# EAGLE design caretaker-easyvr (EAGLE 6.5.0)
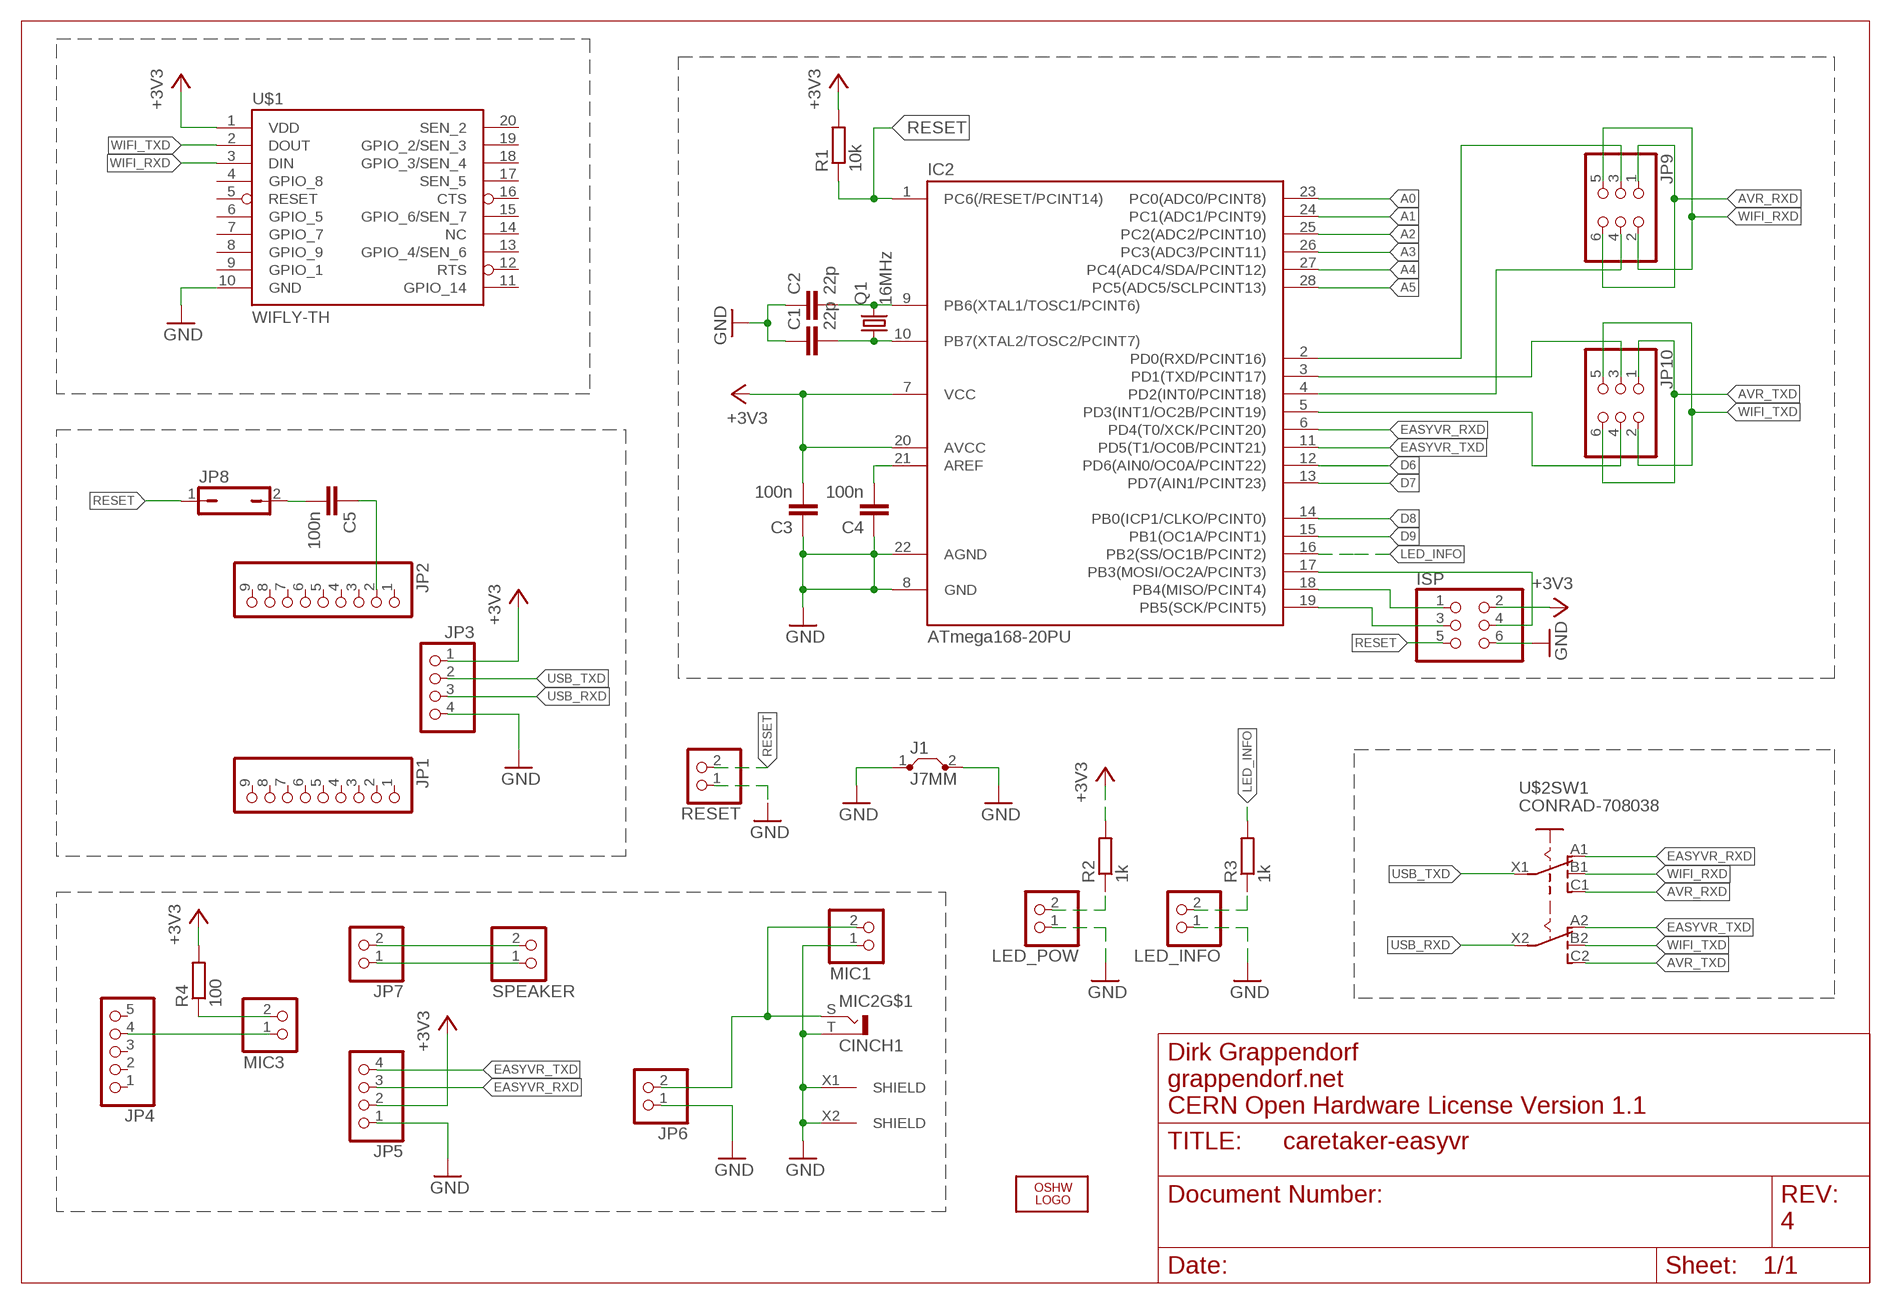
[diagram p0: schematic, sheet 1]

## Parts
C1  22p  C-EU025-025X050  [C025-025X050]
C2  22p  C-EU025-025X050  [C025-025X050]
C3  100n  C-EU025-024X044  [C025-024X044]
C4  100n  C-EU025-024X044  [C025-024X044]
C5  100n  C-EU025-024X044  [C025-024X044]
IC2  ATmega168-20PU  ATMEGA48/88/168-PU  [DIL28-3]
ISP  PINHD-2X3  [2X03]
J1  J7MM  [07]
JP1  PINHD-1X9  [1X09]
JP2  PINHD-1X9  [1X09]
JP3  PINHD-1X4  [1X04]
JP4  PINHD-1X5_2.00  [1X05M]
JP5  PINHD-1X4_2.00  [1X04M]
JP6  PINHD-1X2_2.00  [1X02M]
JP7  PINHD-1X2_2.00  [1X02M]
JP8  JP1Q  [JP1]
JP9  PINHD-2X3_2.54  [2X03]
JP10  PINHD-2X3_2.54  [2X03]
LED_INFO  PINHD-1X2_2.54  [1X02]
LED_POW  PINHD-1X2_2.54  [1X02]
LOGO2  OSHW_LOGO_10MILX0350-NT-BOTTOM  [OSHW_10X350_NOTEXT_BOTTOM]
MIC1  PINHD-1X2_2.54  [1X02]
MIC2  CINCH1  [CINCH1]
MIC3  PINHD-1X2_2.54  [1X02]
Q1  16MHz  CRYSTALHC49U-V  [HC49U-V]
R1  10k  R-EU_0204/7  [0204/7]
R2  1k  R-EU_0204/7  [0204/7]
R3  1k  R-EU_0204/7  [0204/7]
R4  100  R-EU_0204/7  [0204/7]
RESET  PINHD-1X2_2.54  [1X02]
SPEAKER  PINHD-1X2_2.54  [1X02]
U$1  WIFLY-TH  [WIFLY-TH]
U$2  CONRAD-708038  [CONRAD-708038]

## Nets
+3V3: C3.2 IC2.7(VCC) IC2.20(AVCC) ISP.2 JP3.1 JP5.2 R1.2 R2.2 R4.2 U$1.1(VDD)
A0: IC2.23(PC0(ADC0/PCINT8))
A1: IC2.24(PC1(ADC1/PCINT9))
A2: IC2.25(PC2(ADC2/PCINT10))
A3: IC2.26(PC3(ADC3/PCINT11))
A4: IC2.27(PC4(ADC4/SDA/PCINT12))
A5: IC2.28(PC5(ADC5/SCLPCINT13))
AVR_RXD: JP9.1 JP9.6 U$2.C1(SW1:C1)
AVR_TXD: JP10.1 JP10.6 U$2.C2(SW1:C2)
D6: IC2.12(PD6(AIN0/OC0A/PCINT22))
D7: IC2.13(PD7(AIN1/PCINT23))
D8: IC2.14(PB0(ICP1/CLKO/PCINT0))
D9: IC2.15(PB1(OC1A/PCINT1))
EASYVR_RXD: IC2.6(PD4(T0/XCK/PCINT20)) JP5.3 U$2.A1(SW1:A1)
EASYVR_TXD: IC2.11(PD5(T1/OC0B/PCINT21)) JP5.4 U$2.A2(SW1:A2)
GND: C1.1 C2.1 C3.1 C4.1 IC2.8(GND) IC2.22(AGND) ISP.6 J1.1 J1.2 JP3.4 JP5.1 JP6.1 LED_INFO.1 LED_POW.1 MIC1.1 MIC2.T MIC2.X1(SHIELD) MIC2.X2(SHIELD) RESET.1 U$1.10(GND)
LED_INFO: IC2.16(PB2(SS/OC1B/PCINT2)) R3.2
MIC: JP6.2 MIC1.2 MIC2.S
N$5: C2.2 IC2.9(PB6(XTAL1/TOSC1/PCINT6)) Q1.2
N$6: C1.2 IC2.10(PB7(XTAL2/TOSC2/PCINT7)) Q1.1
N$7: C4.2 IC2.21(AREF)
N$8: IC2.18(PB4(MISO/PCINT4)) ISP.1
N$9: IC2.19(PB5(SCK/PCINT5)) ISP.3
N$10: C5.2 JP8.2
N$11: C5.1 JP2.2
N$12: LED_POW.2 R2.1
N$13: LED_INFO.2 R3.1
N$14: JP7.2 SPEAKER.2
N$15: JP7.1 SPEAKER.1
N$16: JP4.4 MIC3.1
N$17: MIC3.2 R4.1
N$18: IC2.2(PD0(RXD/PCINT16)) JP9.3
N$19: IC2.4(PD2(INT0/PCINT18)) JP9.4
N$20: IC2.3(PD1(TXD/PCINT17)) JP10.3
N$21: IC2.5(PD3(INT1/OC2B/PCINT19)) JP10.4
N$22: IC2.17(PB3(MOSI/OC2A/PCINT3)) ISP.4
RESET: IC2.1(PC6(/RESET/PCINT14)) ISP.5 JP8.1 R1.1 RESET.2
USB_RXD: JP3.3 U$2.X2(SW1:X2)
USB_TXD: JP3.2 U$2.X1(SW1:X1)
WIFI_RXD: JP9.2 JP9.5 U$1.3(DIN) U$2.B1(SW1:B1)
WIFI_TXD: JP10.2 JP10.5 U$1.2(DOUT) U$2.B2(SW1:B2)
Unconnected: JP1.1 JP1.2 JP1.3 JP1.4 JP1.5 JP1.6 JP1.7 JP1.8 JP1.9 JP2.1 JP2.3 JP2.4 JP2.5 JP2.6 JP2.7 JP2.8 JP2.9 JP4.1 JP4.2 JP4.3 JP4.5 U$1.4(GPIO_8) U$1.5(RESET) U$1.6(GPIO_5) U$1.7(GPIO_7) U$1.8(GPIO_9) U$1.9(GPIO_1) U$1.11(GPIO_14) U$1.12(RTS) U$1.13(GPIO_4/SEN_6) U$1.14(NC) U$1.15(GPIO_6/SEN_7) U$1.16(CTS) U$1.17(SEN_5) U$1.18(GPIO_3/SEN_4) U$1.19(GPIO_2/SEN_3) U$1.20(SEN_2) U$2.SHIELD1(SHIELD1:SHIELD) U$2.SHIELD2(SHIELD2:SHIELD)

## Notes on the sheet
- Dirk Grappendorf
- grappendorf.net
- CERN Open Hardware License Version 1.1
- 4

## Library data of the parts
C1-C5 = rcl:C-EU: CAPACITOR, European symbol
IC2 = atmega8:ATMEGA48/88/168-PU
ISP = pinhead:PINHD-2X3: PIN HEADER
J1 = jumper:J: Bridge
JP1 JP2 = pinhead:PINHD-1X9: PIN HEADER
JP3 = pinhead:PINHD-1X4: PIN HEADER
JP4 = pinhead-1:PINHD-1X5: PIN HEADER
JP5 = pinhead-1:PINHD-1X4: PIN HEADER
JP6 JP7 LED_INFO LED_POW MIC1 MIC3 RESET SPEAKER = pinhead-1:PINHD-1X2: PIN HEADER
JP8 = jumper:JP1Q: JUMPER
JP9 JP10 = pinhead-1:PINHD-2X3: PIN HEADER
LOGO2 = OSHW:OSHW_LOGO_10MIL
MIC2 = grapelabs-connectors:CINCH1: RCA connectors according to JEITA RC-5231 Cinch RCA-Einbaukupplung nach JEITA RC-5231, abgewinkelte Ausführung Source: http://www.lumberg.de/Produkte/PDFs/WBTOR1.pdf
Q1 = crystal:CRYSTAL: CRYSTAL
R1-R4 = rcl:R-EU_: RESISTOR, European symbol
U$1 = grapelabs:WIFLY
U$2 = grapelabs-switches:CONRAD-708038

## Board
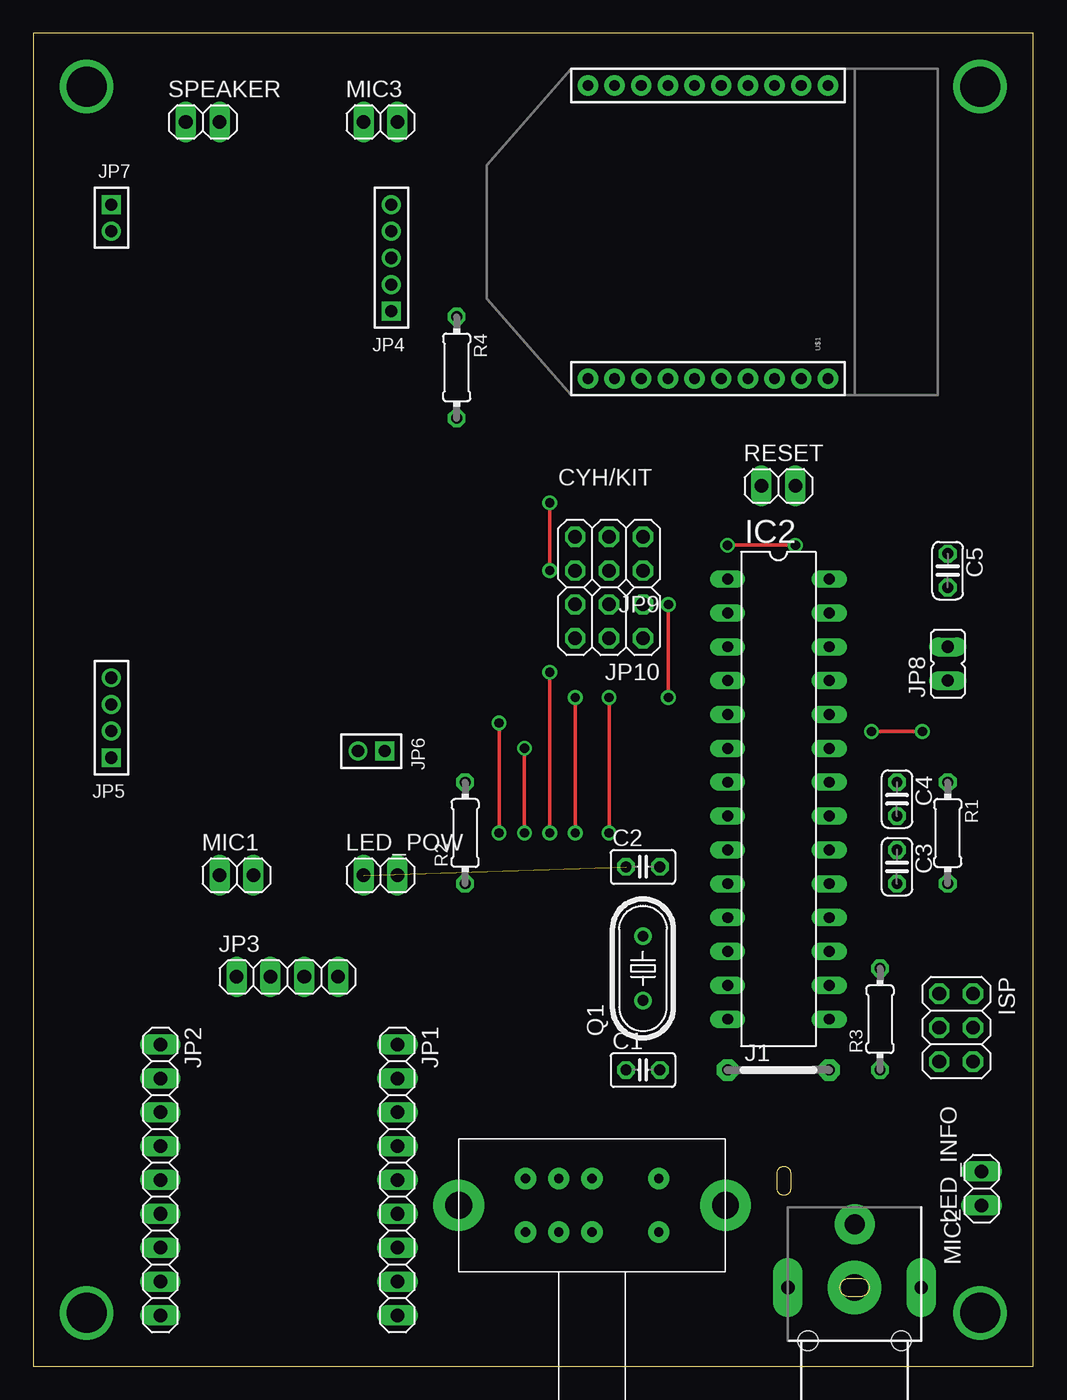
[diagram p1: board, top side]
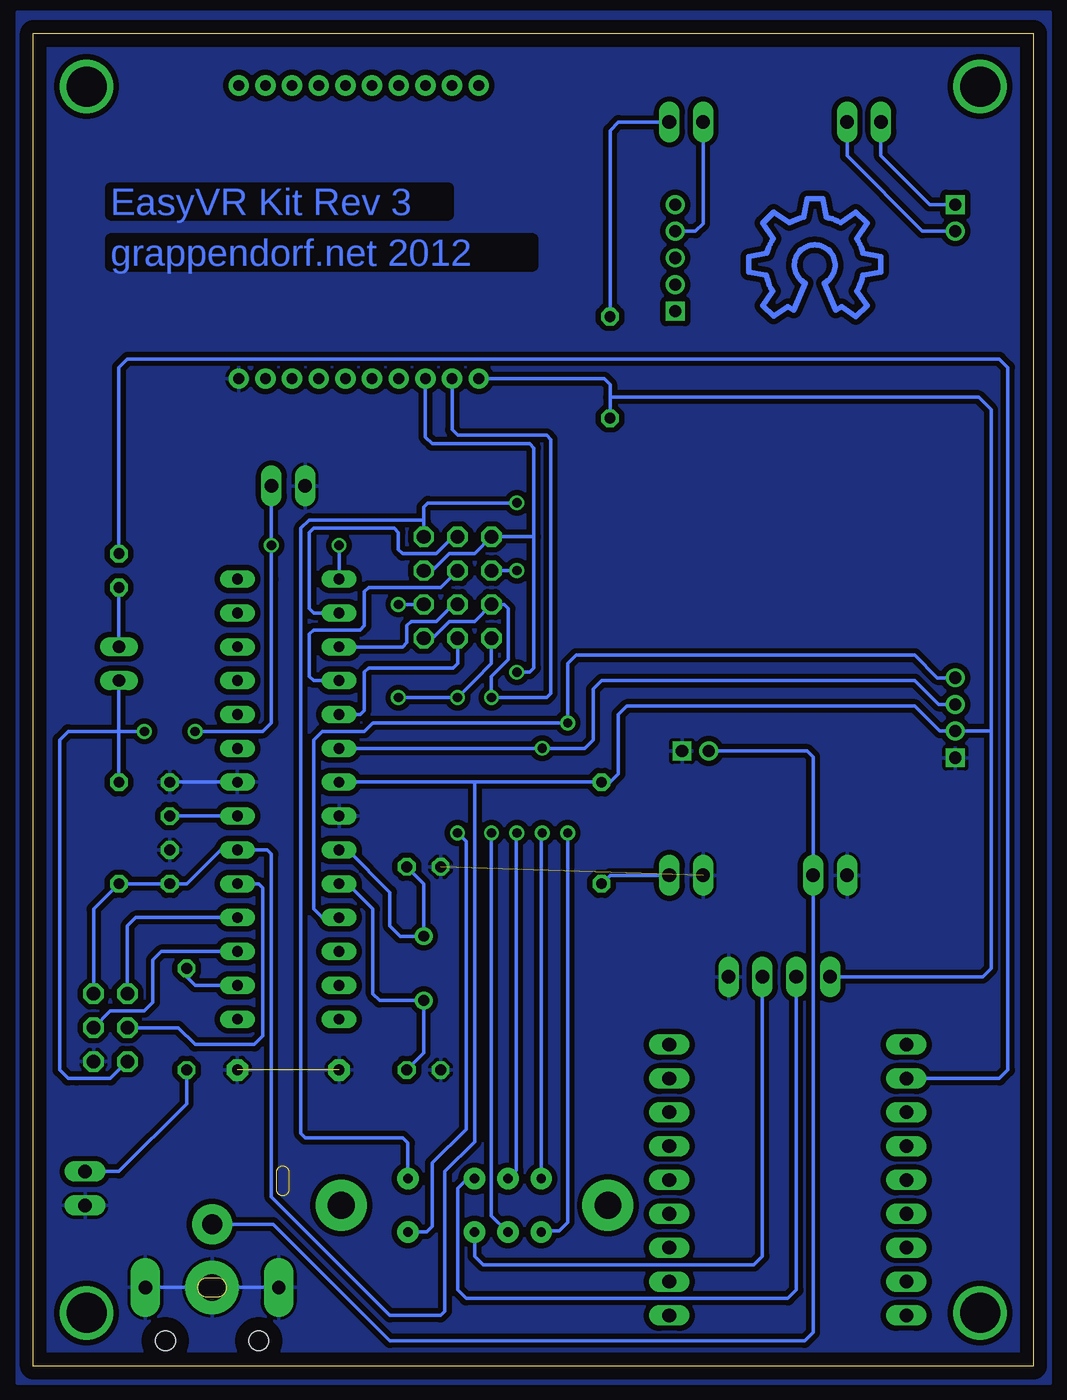
[diagram p2: board, bottom side, seen from below]

Size 75 x 100 mm. Coordinates in mm from the lower left corner, seen from the top.
Outline: 0,0 75,0 75,100 0,100 0,0
Copper layers (1*16): Top 0.035mm / dielectric 1.5mm / Bottom 0.035mm
Design rules "default": minimum track width 10mil, minimum drill 24mil, track to track 8mil, track to pad 8mil, pad to pad 8mil, via to via 8mil, smd to smd 8mil, copper to edge 40mil, drill to drill 8mil, minimum pad ring 10mil, minimum via ring 8mil, stop-mask expansion 4mil, vias tented up to drill 0mil, thermal gap 10mil

### Footprints (pad centres in the part's own frame; a part is rotated, then mirrored left to right if it is on the bottom)
C025-025X050 = drill 0.813 octagon: 1 -1.27,0; 2 1.27,0
C025-024X044 = drill 0.813 octagon: 1 -1.27,0; 2 1.27,0
DIL28-3 = drill 0.813 long: 1 -16.51,-3.81; 2 -13.97,-3.81; 3 -11.43,-3.81; 4 -8.89,-3.81; 5 -6.35,-3.81; 6 -3.81,-3.81; 7 -1.27,-3.81; 8 1.27,-3.81; 9 3.81,-3.81; 10 6.35,-3.81; 11 8.89,-3.81; 12 11.43,-3.81; 13 13.97,-3.81; 14 16.51,-3.81; 15 16.51,3.81; 16 13.97,3.81; 17 11.43,3.81; 18 8.89,3.81; 19 6.35,3.81; 20 3.81,3.81; 21 1.27,3.81; 22 -1.27,3.81; 23 -3.81,3.81; 24 -6.35,3.81; 25 -8.89,3.81; 26 -11.43,3.81; 27 -13.97,3.81; 28 -16.51,3.81
2X03 = drill 1.016 octagon: 1 -2.54,-1.27; 2 -2.54,1.27; 3 0,-1.27; 4 0,1.27; 5 2.54,-1.27; 6 2.54,1.27
07 = drill 0.813 pad 1.6 octagon: 1 -3.81,0; 2 3.81,0
1X09 = drill 1.016 long: 1 -10.16,0; 2 -7.62,0; 3 -5.08,0; 4 -2.54,0; 5 0,0; 6 2.54,0; 7 5.08,0; 8 7.62,0; 9 10.16,0
1X04 = drill 1.016 long: 1 -3.81,0; 2 -1.27,0; 3 1.27,0; 4 3.81,0
1X05M = drill 0.914 square: 1 -4,0 | drill 0.914: 2 -2,0; 3 0,0; 4 2,0; 5 4,0
1X04M = drill 0.914 square: 1 -3,0 | drill 0.914: 2 -1,0; 3 1,0; 4 3,0
1X02M = drill 0.914 square: 1 -1,0 | drill 0.914: 2 1,0
JP1 = drill 0.914 long: 1 0,-1.27; 2 0,1.27
1X02 = drill 1.016 long: 1 -1.27,0; 2 1.27,0
CINCH1 = drill 1.5 pad 3: S 0,-8.75 | drill 2 pad 4: T 0,-4 | drill 1 pad 2.2 long: X1 5,-4; X2 -5,-4 | hole 1.5: -3.5,0; 3.5,0
HC49U-V = drill 0.813: 1 -2.413,0; 2 2.413,0
0204/7 = drill 0.813 octagon: 1 -3.81,0; 2 3.81,0
WIFLY-TH = drill 0.8 pad 1.524: 1 -11,20; 2 -11,18; 3 -11,16; 4 -11,14; 5 -11,12; 6 -11,10; 7 -11,8; 8 -11,6; 9 -11,4; 10 -11,2; 11 11,2; 12 11,4; 13 11,6; 14 11,8; 15 11,10; 16 11,12; 17 11,14; 18 11,16; 19 11,18; 20 11,20
CONRAD-708038 = drill 0.7 pad 1.6: A1 -5,2; A2 -5,-2; B1 -2.5,2; B2 -2.5,-2; C1 5,2; C2 5,-2; X1 0,2; X2 0,-2 | drill 2 pad 3.81: SHIELD1 -10,0; SHIELD2 10,0

### Placement (x,y rotation side)
C1  45.72,22.23 0 top
C2  45.72,37.47 0 top
C3  64.77,37.47 270 top
C4  64.77,42.55 270 top
C5  68.58,59.69 270 top
IC2  55.88,42.55 270 top
ISP  69.22,25.4 270 top
J1  55.88,22.23 0 top
JP1  27.3,13.97 270 top
JP2  9.53,13.97 270 top
JP3  19.05,29.21 0 top
JP4  26.85,83.15 90 top
JP5  5.85,48.65 90 top
JP6  25.35,46.15 180 top
JP7  5.85,86.15 270 top
JP8  68.58,52.7 0 top
JP9  43.18,60.96 180 top
JP10  43.18,55.88 180 top
LED_INFO  71.12,13.34 90 top
LED_POW  26.04,36.83 0 top
LOGO2  16.51,82.55 0 top
MIC1  15.24,36.83 0 top
MIC2  61.59,1.91 180 top
MIC3  26.04,93.34 0 top
Q1  45.72,29.84 90 top
R1  68.58,40.01 270 top
R2  32.38,40.01 90 top
R3  63.5,26.04 90 top
R4  31.75,74.93 270 top
RESET  55.88,66.04 0 top
SPEAKER  12.7,93.34 0 top
U$1  61.59,85.09 90 top
U$2  41.91,12.06 0 top

### Tracks (layer width: path | path; a pad name or v marks a point on that pad's centre or on a via)
+3V3
  Bottom 0.254: JP3.1 3.81,29.21 3.17,29.84 3.17,47.62 | JP5.2 5.83,47.62 | 31.75,72.69 4.11,72.69 3.17,71.75 3.17,47.62 | JP5.2 3.2,47.65 3.17,47.62 | JP5.2 7.01,47.65 8.89,49.53 30.48,49.53 31.11,48.9 31.11,44.45 31.75,43.81 | 41.91,43.81 IC2.7 | 41.91,43.81 41.91,16.83 44.13,14.61 44.13,4.13 44.45,3.81 48.26,3.81 57.15,12.7 57.15,38.42 57.47,38.73 IC2.20 60.96,38.73 63.5,36.2 C3.2 R1.2 70.48,34.29 ISP.2 | 31.75,43.81 R2.2 | 31.75,43.81 41.91,43.81 | 31.75,72.69 R4.2 | U$1.1 32.18,74.09 31.75,73.66 31.75,72.69
AVR_RXD  (via drill 0.7)
  Top 0.254: v38.73,64.77 v38.73,59.69
  Bottom 0.254: v38.73,59.69 JP9.6 | v38.73,64.77 45.4,64.77 45.72,64.45 45.72,63.5 | 45.72,63.5 JP9.1 | U$2.C1 46.91,16.75 47.31,17.14 54.61,17.14 54.93,17.46 54.93,62.87 54.29,63.5 45.72,63.5
AVR_TXD  (via drill 0.7)
  Top 0.254: v43.18,40.01 v43.18,50.16 | v47.62,50.16 v47.62,57.15
  Bottom 0.254: U$2.C2 45.5,10.06 45.09,10.48 45.09,15.24 42.55,17.78 42.55,39.37 v43.18,40.01 | JP10.6 40.64,52.7 41.91,51.44 v43.18,50.16 v47.62,50.16 | v47.62,57.15 JP10.1
EASYVR_RXD  (via drill 0.7)
  Top 0.254: v36.83,40.01 v36.83,46.35
  Bottom 0.254: JP5.3 7.11,49.65 8.89,51.44 32.38,51.44 33.02,50.8 33.02,46.99 33.66,46.35 v36.83,46.35 IC2.6 | 36.91,39.92 v36.83,40.01 36.91,39.92 | U$2.A1 36.91,39.92
EASYVR_TXD  (via drill 0.7)
  Top 0.254: v34.92,40.01 v34.92,48.26
  Bottom 0.254: JP5.4 7.2,51.65 8.89,53.34 34.29,53.34 34.92,52.7 v34.92,48.26 49.53,48.26 50.16,47.62 53.34,47.62 53.98,46.99 53.98,34.29 53.34,33.66 IC2.11 | v34.92,40.01 34.92,13.97 34.92,12.7 34.92,10.79 35.56,10.16 36.81,10.16 U$2.A2
GND  (2 unrouted)
  Bottom 0.254: MIC2.X1 MIC2.T MIC2.X2 67.5,5.91 | IC2.22 C4.1
  pour Bottom (isolate 0.406): -1.27,101.6 76.2,101.6 76.2,-1.27 -1.27,-1.27
LED_INFO
  Bottom 0.254: R3.2 63.5,29.21 62.87,28.57 IC2.16
MIC
  Bottom 0.254: MIC2.S 57.01,10.65 48.58,2.22 | 48.26,1.91 48.58,2.22 | JP6.2 16.94,46.15 16.51,45.72 MIC1.2 16.51,2.54 17.14,1.91 48.26,1.91 | 48.26,1.91 48.58,2.22
N$1  (via drill 3)
  other vias: 4,4
N$2  (via drill 3)
  other vias: 71,4
N$3  (via drill 3)
  other vias: 71,96
N$4  (via drill 3)
  other vias: 4,96
N$5
  Bottom 0.254: C2.2 45.72,36.2 Q1.2 47.5,32.26 48.26,33.02 48.26,35.56 51.44,38.73 IC2.9
N$6
  Bottom 0.254: C1.2 45.72,23.5 Q1.1 49.02,27.43 49.53,27.94 49.53,34.29 51.44,36.2 IC2.10
N$7
  Bottom 0.254: IC2.21 C4.2
N$8
  Bottom 0.254: IC2.18 67.31,33.66 67.94,33.02 ISP.1
N$9
  Bottom 0.254: IC2.19 58.1,36.2 57.78,35.88 57.78,24.77 58.42,24.13 62.87,24.13 64.14,25.4 ISP.3
N$10
  Bottom 0.254: JP8.2 C5.2
N$11
  Bottom 0.254: C5.1 68.58,74.93 67.94,75.56 2.54,75.56 1.91,74.93 1.91,22.23 2.54,21.59 JP2.2
N$12
  Bottom 0.254: R2.1 31.75,36.83 LED_POW.2
N$13
  Bottom 0.254: R3.1 63.5,19.68 68.58,14.61 LED_INFO.2
N$14
  Bottom 0.254: JP7.2 8.31,85.15 13.97,90.81 SPEAKER.2
N$15
  Bottom 0.254: JP7.1 7.78,87.15 11.43,90.81 SPEAKER.1
N$16
  Bottom 0.254: JP4.4 25.34,85.15 24.77,85.72 MIC3.1
N$17
  Bottom 0.254: MIC3.2 31.11,93.34 31.75,92.71 R4.1
N$18
  Bottom 0.254: JP9.3 43.5,62.23 44.77,60.96 47.31,60.96 47.62,61.28 47.62,62.55 47.94,62.87 53.98,62.87 54.29,62.55 54.29,56.83 53.98,56.52 IC2.2
N$19
  Bottom 0.254: IC2.4 53.98,51.44 54.29,51.75 54.29,54.93 53.98,55.24 50.48,55.24 50.16,55.56 50.16,58.1 49.85,58.42 44.45,58.42 JP9.4
N$20
  Bottom 0.254: IC2.3 47.31,53.98 46.99,54.29 46.99,55.56 46.67,55.88 44.77,55.88 43.5,57.15 JP10.3
N$21
  Bottom 0.254: JP10.4 43.18,52.7 43.5,52.39 49.85,52.39 50.16,52.07 50.16,49.21 50.48,48.9 IC2.5
N$22
  Bottom 0.254: ISP.4 69.22,26.67 66.67,26.67 66.04,27.3 66.04,29.84 66.04,30.48 65.41,31.11 IC2.17
RESET  (via drill 0.7)
  Top 0.254: v66.67,47.62 v62.87,47.62 | v52.07,61.59 54.29,61.59 v57.15,61.59
  Bottom 0.254: ISP.5 69.22,21.59 71.75,21.59 72.39,21.59 73.03,22.23 73.03,46.99 72.39,47.62 68.58,47.62 | 68.58,47.62 JP8.1 | 68.58,47.62 v66.67,47.62 | 68.58,47.62 R1.1 | v62.87,47.62 57.78,47.62 57.15,48.26 57.15,59.05 v57.15,61.59 RESET.2 | v52.07,61.59 IC2.1
USB_RXD
  Bottom 0.254: JP3.3 20.32,8.26 20.95,7.62 41.27,7.62 41.91,8.26 U$2.X2
USB_TXD
  Bottom 0.254: JP3.2 17.78,5.71 18.41,5.08 42.55,5.08 43.18,5.71 43.18,13.34 42.55,13.97 42.01,13.97 U$2.X1
WIFI_RXD  (via drill 0.7)
  Top 0.254: v38.73,40.01 v38.73,52.07
  Bottom 0.254: v38.73,40.01 38.77,39.97 38.77,14.7 U$2.B1 | JP9.2 45.09,59.69 43.81,60.96 41.91,60.96 JP9.5 37.47,62.23 | 37.47,62.23 37.47,68.9 37.78,69.22 45.09,69.22 45.59,69.72 U$1.3 | 37.47,62.23 37.47,52.39 37.78,52.07 v38.73,52.07
WIFI_TXD  (via drill 0.7)
  Top 0.254: v40.64,40.01 v40.64,50.16
  Bottom 0.254: v40.64,40.01 40.64,11.43 40.64,11.29 U$2.B2 | JP10.2 45.09,54.61 43.81,55.88 41.91,55.88 JP10.5 39.69,57.15 39.37,56.83 39.37,53.02 40.64,51.75 v40.64,50.16 36.51,50.16 36.2,50.48 36.2,69.53 36.51,69.85 43.18,69.85 43.59,70.27 U$1.2

### Text on the board
Bottom: EasyVR Kit Rev 3 | grappendorf.net 2012
tNames: CYH/KIT